# Altium schematic sheet psu_toggle_switch.SchDoc
size A4
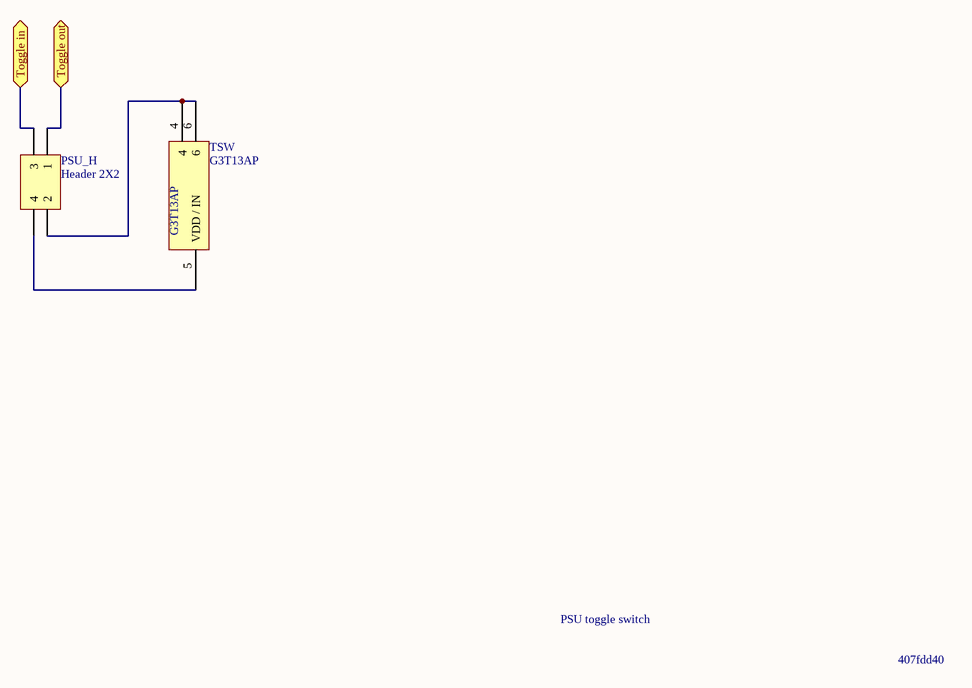
[diagram p0: psu_toggle_switch.SchDoc]

## Parts
PSU_H  Header 2X2  [HDR2X2]
TSW  G3T13AP  [G3T13AP]

## Ports
Toggle in, Toggle out

## Nets
Toggle in: PSU_H.3 ; port Toggle in
Toggle out: PSU_H.1 ; port Toggle out
NetPSU_H_2: PSU_H.2 TSW.4 TSW.6
NetPSU_H_4: PSU_H.4 TSW.5(VDD_/_IN)

## Notes on the sheet
- PSU toggle switch
- 407fdd40

## Library data of the parts
PSU_H = Header 2X2: Header, 2-Pin, Dual row; LatestRevisionDate: 17-Jul-2002; LatestRevisionNote: Re-released for DXP Platform.; Publisher: Altium Limited